# EasyEDA Pro project Projeto2.eprj

# Schematic Esquema com BJT
Board Name: Board1; Create Date: 2026-02-03; Page Name: P1; Project Name: Projeto2; Schematic Name: Schematic1; Update Date: 2026-02-03; Company: EasyEDA.com; Page Size: A4; Version: V1.0
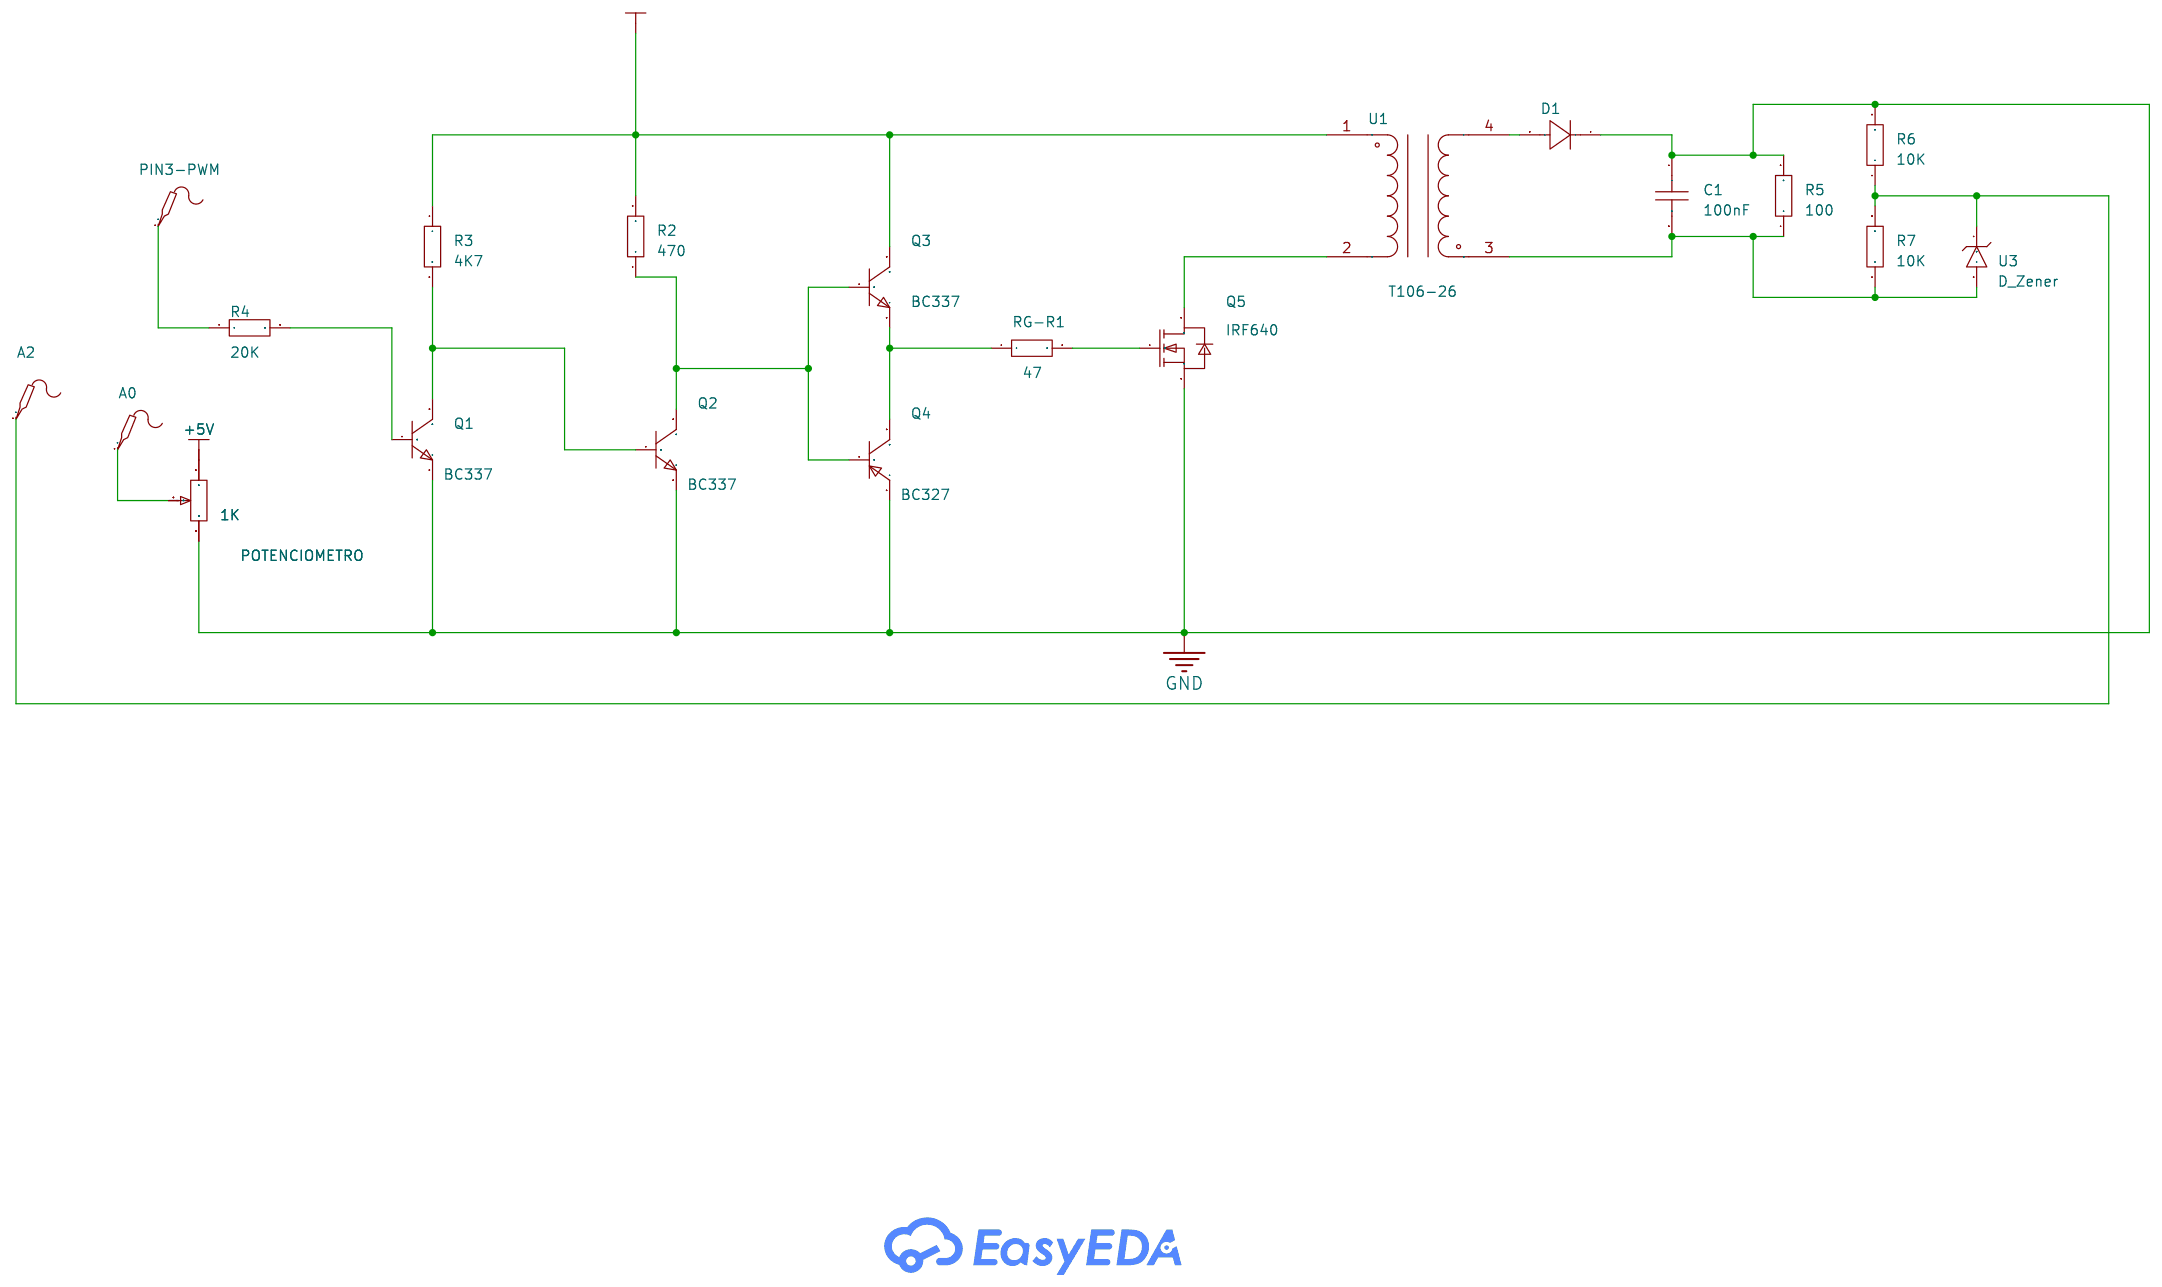
[diagram p0: schematic sheet]

## Parts
A0  -  [Test-Point-0.5mm]
A2  -  [Test-Point-0.5mm]
C1  100nF  [C0201]
D1  -  [DO-41_BD2.4-L4.7-P8.70-D0.9-RD]
PIN3-PWM  -  [Test-Point-0.5mm]
POTENCIOMETRO  1K  [RES-ADJ-TH_3P-L9.5-W9.5-P2.54-BR-BS]
Q1  BC337  [SOT-23_L2.9-W1.3-P1.90-LS2.4-BR]
Q2  BC337  [SOT-23_L2.9-W1.3-P1.90-LS2.4-BR]
Q3  BC337  [SOT-23_L2.9-W1.3-P1.90-LS2.4-BR]
Q4  BC327  [TO-236-3_L2.9-W1.3-P1.90-LS2.4-BR]
Q5  IRF640  [TO-220-3_L10.0-W4.5-P2.54-L]
R2  470  [R0603]
R3  4K7  [R0603]
R4  20K  [R0603]
R5  100  [R0603]
R6  10K  [R0603]
R7  10K  [R0603]
RG-R1  47  [R0603]
U1  T106-26  [XFMR-TH_TCC-J2208-5MH]
U3  D_Zener  [SOD-323_L1.6-W1.2-LS2.6-RD]

## Library data of the parts
A0 A2 PIN3-PWM = Test-Point
C1 = CAP_0201: Supplier Footprint: 0201
D1 = 1N4007: Supplier Footprint: DO-41
POTENCIOMETRO = R_3386P: Supplier Footprint: Through
Q1-Q3 = S8050_NPN: Supplier Footprint: SOT-23
Q4 = S8550_PNP: Supplier Footprint: SOT-23
Q5 = IRF640: LCSC Part Name: N沟道,电流:18A,耐压:200V; Supplier Part: C5122558; Manufacturer: Slkor(萨科微); Supplier Footprint: TO-220; JLCPCB Part Class: Extended Part; Datasheet: https://atta.szlcsc.com/upload/public/pdf/source/20220805/B38E3581582BB90DD5297E6153D4DFE0.pdf; Supplier: LCSC; Type: 1 N-channel; Current - Continuous Drain(Id): 18A; Pd - Power Dissipation: 150W; Operating Temperature: -55℃~+175℃
R2-R7 RG-R1 = Res_0603: Supplier Footprint: 0603
U1 = TCC-WJ2812-303D: Supplier Part: C9900046386; Supplier Footprint: EE13; Supplier: LCSC
U3 = D_Zener_SOD323: Supplier Part: C2929304; Supplier Footprint: SOD-323; JLCPCB Part Class: Extended Part; Supplier: LCSC

## Nets
+5V: POTENCIOMETRO.1
GND: C1.1 D1.1(K) POTENCIOMETRO.3 Q1.2(E) Q2.2(E) Q4.2(E) Q5.3(S) R5.2 R6.2
VCC-12V: Q3.3(C) R2.2 R3.1 U1.1
Net-(A0-1): A0.1 POTENCIOMETRO.2
Net-(A2-1): A2.1 R6.1 R7.2 U3.1(C)
Net-(C1-2): C1.2 R5.1 R7.1 U1.3 U3.2(A)
Net-(D1-2): D1.2(A) U1.4
Net-(PIN3-PWM-1): PIN3-PWM.1 R4.1
Net-(Q1-1): Q1.1(B) R4.2
Net-(Q1-3): Q1.3(C) Q2.1(B) R3.2
Net-(Q2-3): Q2.3(C) Q3.1(B) Q4.1(B) R2.1
Net-(Q3-2): Q3.2(E) Q4.3(C) RG-R1.1
Net-(Q5-1): Q5.1(G) RG-R1.2
Net-(Q5-2): Q5.2(D) U1.2

# Schematic Esquema com Opto Acoplador
Create Date: 2026-02-03; Page Name: P1; Project Name: Projeto2; Schematic Name: Esquema com Opto Acoplador; Update Date: 2026-02-07; Company: EasyEDA.com; Page Size: A4; Version: V1.0
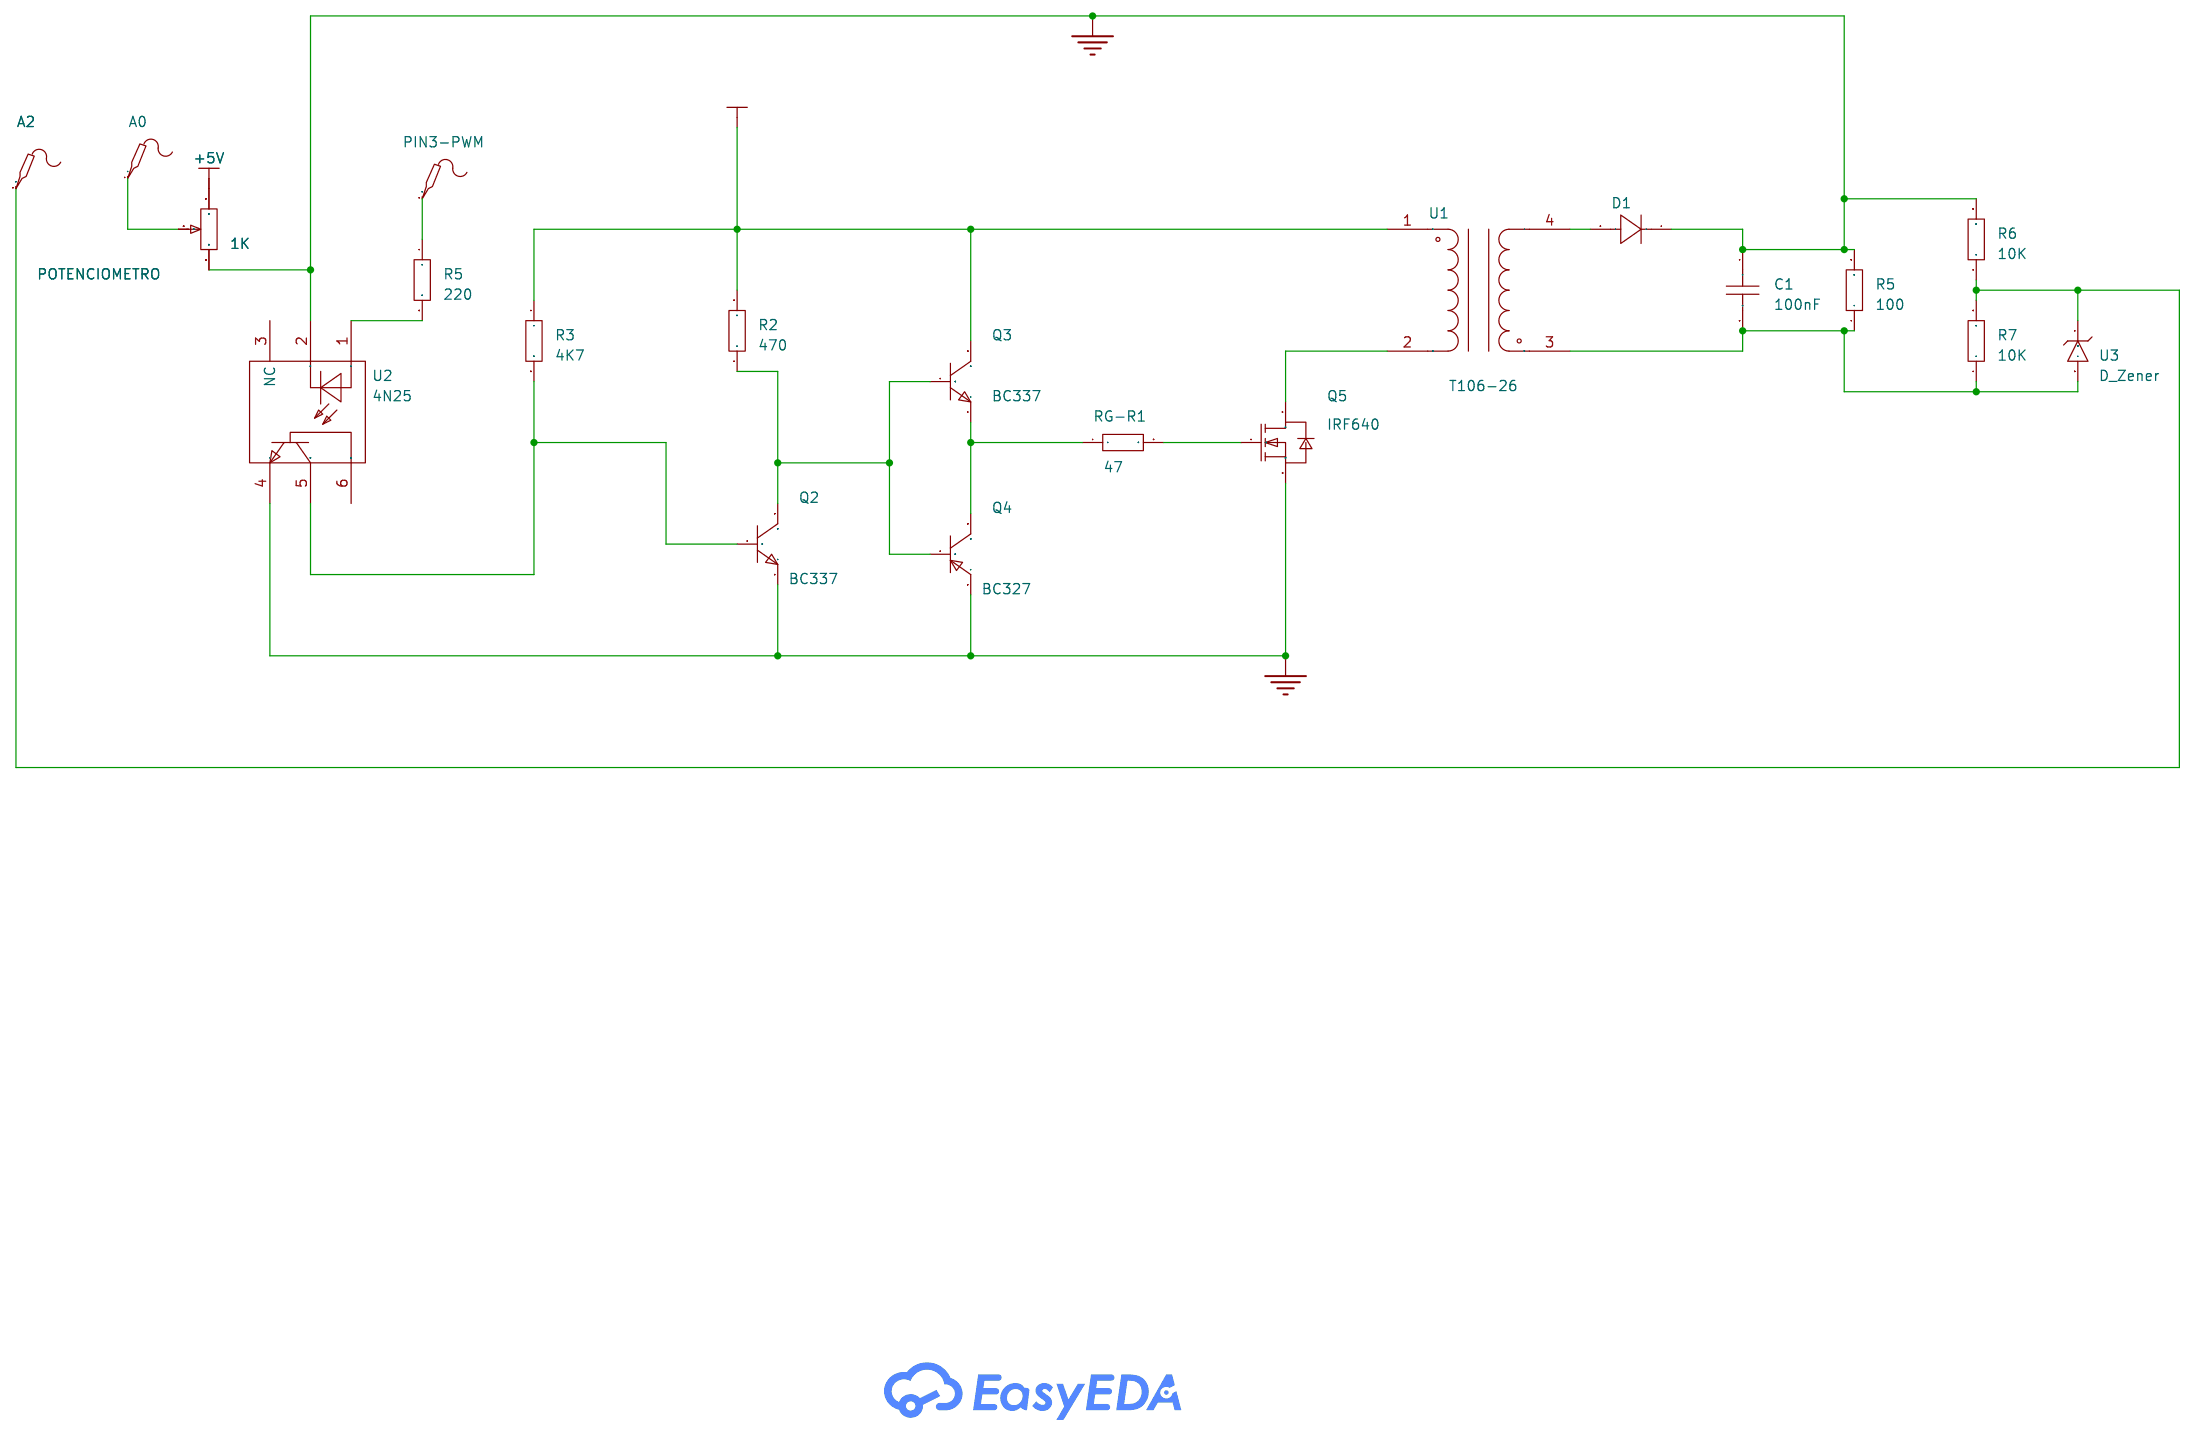
[diagram p1: schematic sheet]

## Parts
A0  -  [Test-Point-0.5mm]
A2  -  [Test-Point-0.5mm]
C1  100nF  [C0201]
D1  -  [DO-41_BD2.4-L4.7-P8.70-D0.9-RD]
PIN3-PWM  -  [Test-Point-0.5mm]
POTENCIOMETRO  1K  [RES-ADJ-TH_3P-L9.5-W9.5-P2.54-BR-BS]
Q2  BC337  [SOT-23_L2.9-W1.3-P1.90-LS2.4-BR]
Q3  BC337  [SOT-23_L2.9-W1.3-P1.90-LS2.4-BR]
Q4  BC327  [TO-236-3_L2.9-W1.3-P1.90-LS2.4-BR]
Q5  IRF640  [TO-220-3_L10.0-W4.5-P2.54-L]
R2  470  [R0603]
R3  4K7  [R0603]
R5  100  [R0603]
R5#2  220  [R0603]
R6  10K  [R0603]
R7  10K  [R0603]
RG-R1  47  [R0603]
U1  T106-26  [XFMR-TH_TCC-J2208-5MH]
U2  4N25  [DIP-6_L7.1-W6.5-P2.54-LS7.6-BL]
U3  D_Zener  [SOD-323_L1.6-W1.2-LS2.6-RD]

## Library data of the parts
A0 A2 PIN3-PWM = Test-Point
C1 = CAP_0201: Supplier Footprint: 0201
D1 = 1N4007: Supplier Footprint: DO-41
POTENCIOMETRO = R_3386P: Supplier Footprint: Through
Q2 Q3 = S8050_NPN: Supplier Footprint: SOT-23
Q4 = S8550_PNP: Supplier Footprint: SOT-23
Q5 = IRF640: LCSC Part Name: N沟道,电流:18A,耐压:200V; Supplier Part: C5122558; Manufacturer: Slkor(萨科微); Supplier Footprint: TO-220; JLCPCB Part Class: Extended Part; Datasheet: https://atta.szlcsc.com/upload/public/pdf/source/20220805/B38E3581582BB90DD5297E6153D4DFE0.pdf; Supplier: LCSC; Type: 1 N-channel; Current - Continuous Drain(Id): 18A; Pd - Power Dissipation: 150W; Operating Temperature: -55℃~+175℃
R2 R3 R5 R5#2 R6 R7 RG-R1 = Res_0603: Supplier Footprint: 0603
U1 = TCC-WJ2812-303D: Supplier Part: C9900046386; Supplier Footprint: EE13; Supplier: LCSC
U2 = 4N25: Supplier Part: C3008818; Manufacturer: VISHAY(威世); Supplier Footprint: DIP-6; JLCPCB Part Class: Extended Part; Datasheet: https://atta.szlcsc.com/upload/public/pdf/source/20220512/DCD730118474C0EE1EA694047C839E34.pdf; Supplier: LCSC; Forward Voltage: 1.3V; Output Current: 50mA; Isolation Voltage(rms): 5kV; Number of Outputs: 1; Rise time: 2us; Fall time: 2us; Operating Temperature: -55℃~+100℃
U3 = D_Zener_SOD323: Supplier Part: C2929304; Supplier Footprint: SOD-323; JLCPCB Part Class: Extended Part; Supplier: LCSC

## Nets
+5V: POTENCIOMETRO.1
GND_ARDUINO: C1.1 D1.1(K) POTENCIOMETRO.3 R5.2 R6.2 U2.2
GND_FONTE: Q2.2(E) Q4.2(E) Q5.3(S) U2.4
VCC-12V: Q3.3(C) R2.2 R3.1 U1.1
Net-(A0-1): A0.1 POTENCIOMETRO.2
Net-(A2-1): A2.1 R6.1 R7.2 U3.1(C)
Net-(C1-2): C1.2 R5.1 R7.1 U1.3 U3.2(A)
Net-(D1-2): D1.2(A) U1.4
Net-(PIN3-PWM-1): PIN3-PWM.1 R5#2.1
Net-(Q2-1): Q2.1(B) R3.2 U2.5
Net-(Q2-3): Q2.3(C) Q3.1(B) Q4.1(B) R2.1
Net-(Q3-2): Q3.2(E) Q4.3(C) RG-R1.1
Net-(Q5-1): Q5.1(G) RG-R1.2
Net-(Q5-2): Q5.2(D) U1.2
Net-(R5#2-2): R5#2.2 U2.1

Not connected (* = marked no-connect by the designer): U2 3(NC) 6

# Schematic Esquema Malha Fechada
Board Name: Board1_1; Create Date: 2026-02-09; Page Name: P1; Project Name: Projeto2; Schematic Name: Esquema Malha Fechada; Update Date: 2026-02-08; Company: EasyEDA.com; Page Size: A4; Version: V1.0
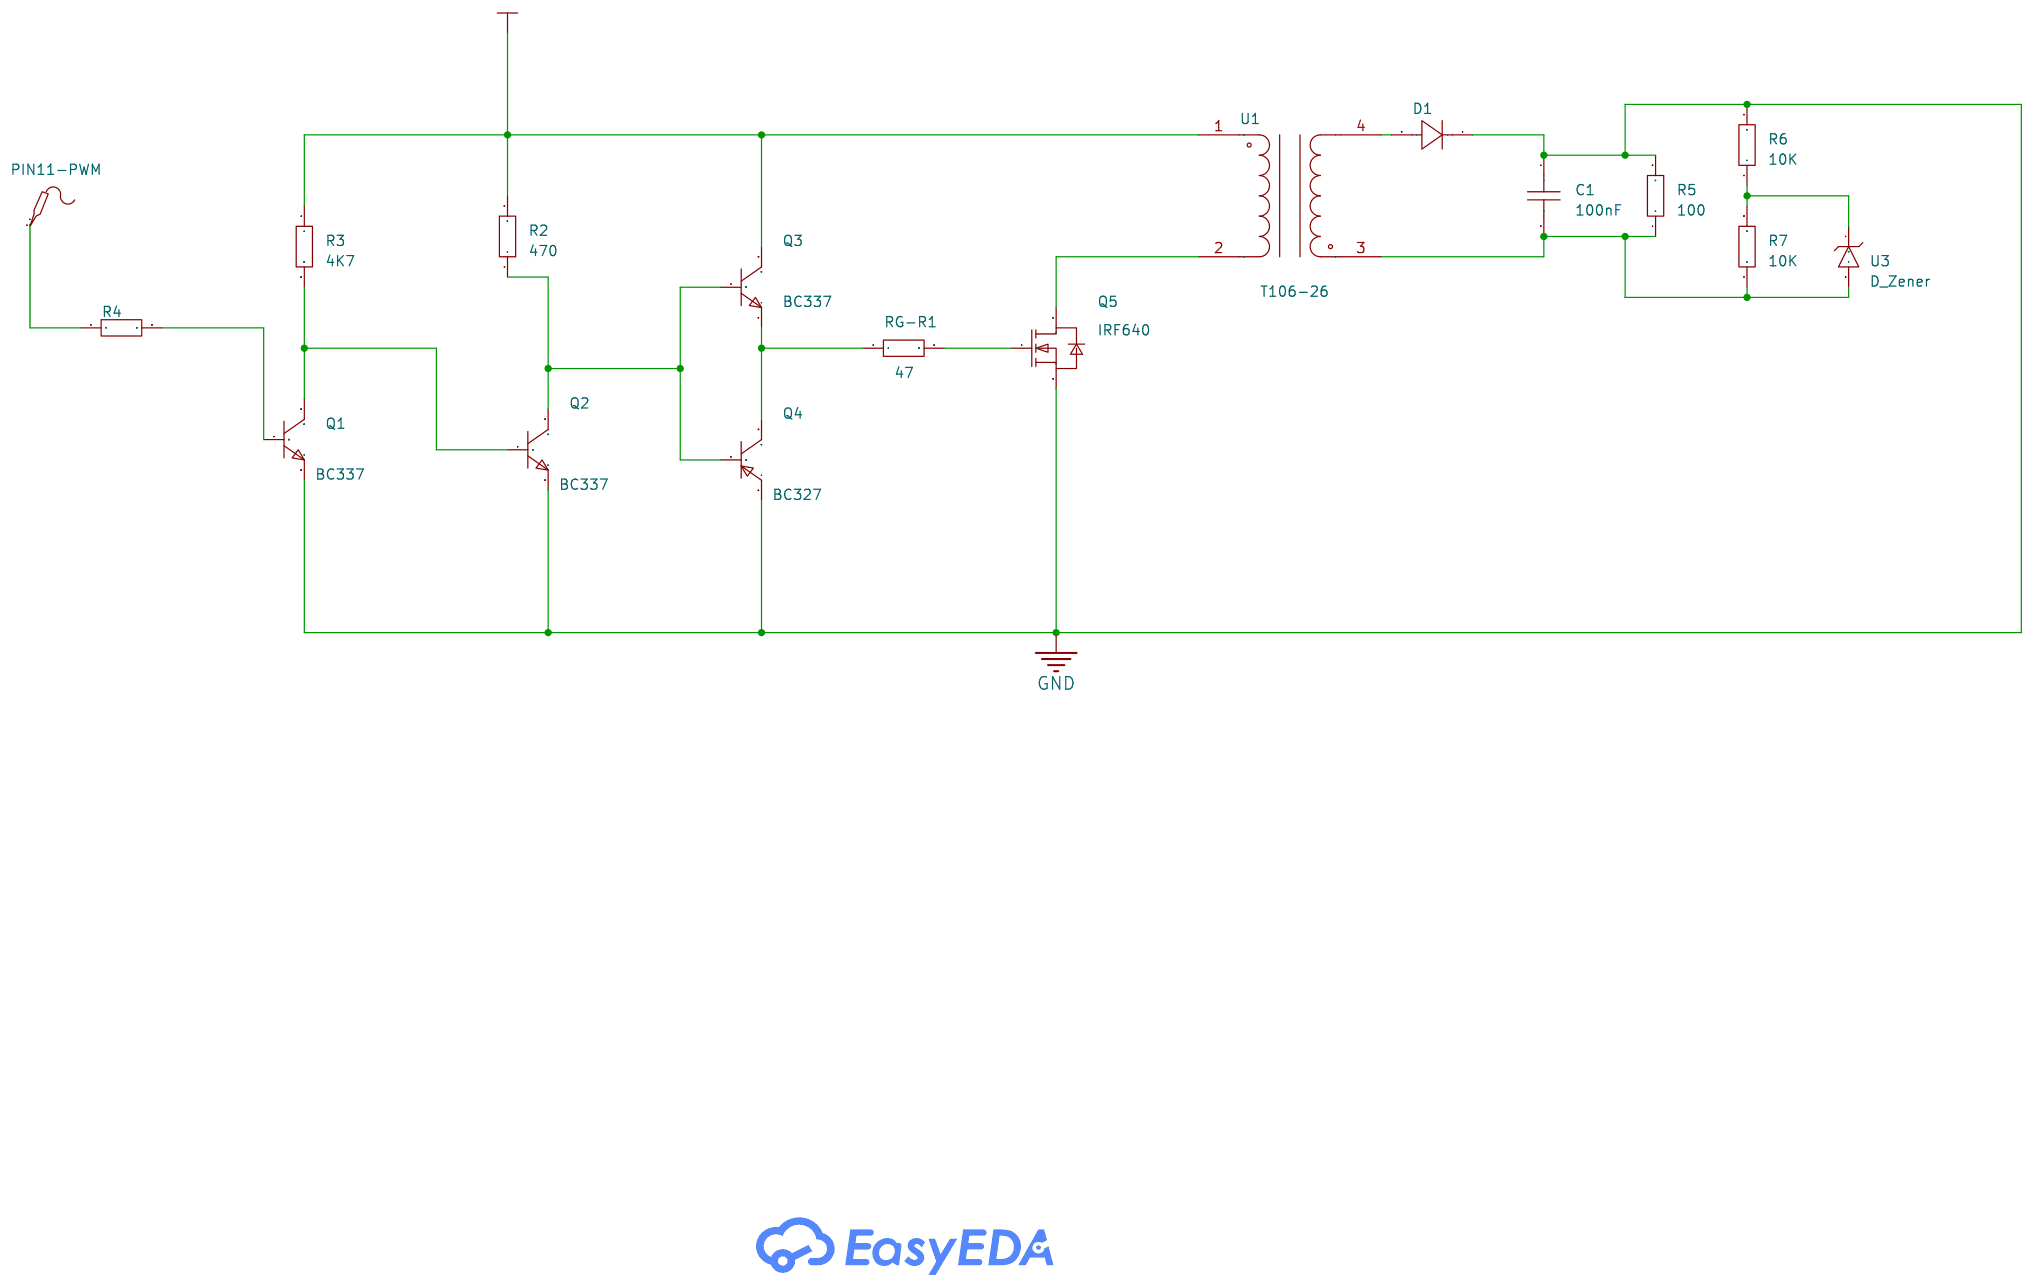
[diagram p2: schematic sheet]

## Parts
C1  100nF  [C0201]
D1  -  [DO-41_BD2.4-L4.7-P8.70-D0.9-RD]
PIN11-PWM  -  [Test-Point-0.5mm]
Q1  BC337  [SOT-23_L2.9-W1.3-P1.90-LS2.4-BR]
Q2  BC337  [SOT-23_L2.9-W1.3-P1.90-LS2.4-BR]
Q3  BC337  [SOT-23_L2.9-W1.3-P1.90-LS2.4-BR]
Q4  BC327  [TO-236-3_L2.9-W1.3-P1.90-LS2.4-BR]
Q5  IRF640  [TO-220-3_L10.0-W4.5-P2.54-L]
R2  470  [R0603]
R3  4K7  [R0603]
R4  20K  [R0603]
R5  100  [R0603]
R6  10K  [R0603]
R7  10K  [R0603]
RG-R1  47  [R0603]
U1  T106-26  [XFMR-TH_TCC-J2208-5MH]
U3  D_Zener  [SOD-323_L1.6-W1.2-LS2.6-RD]

## Library data of the parts
C1 = CAP_0201: Supplier Footprint: 0201
D1 = 1N4007: Supplier Footprint: DO-41
PIN11-PWM = Test-Point
Q1-Q3 = S8050_NPN: Supplier Footprint: SOT-23
Q4 = S8550_PNP: Supplier Footprint: SOT-23
Q5 = IRF640: LCSC Part Name: N沟道,电流:18A,耐压:200V; Supplier Part: C5122558; Manufacturer: Slkor(萨科微); Supplier Footprint: TO-220; JLCPCB Part Class: Extended Part; Datasheet: https://atta.szlcsc.com/upload/public/pdf/source/20220805/B38E3581582BB90DD5297E6153D4DFE0.pdf; Supplier: LCSC; Type: 1 N-channel; Current - Continuous Drain(Id): 18A; Pd - Power Dissipation: 150W; Operating Temperature: -55℃~+175℃
R2-R7 RG-R1 = Res_0603: Supplier Footprint: 0603
U1 = TCC-WJ2812-303D: Supplier Part: C9900046386; Supplier Footprint: EE13; Supplier: LCSC
U3 = D_Zener_SOD323: Supplier Part: C2929304; Supplier Footprint: SOD-323; JLCPCB Part Class: Extended Part; Supplier: LCSC

## Nets
GND: C1.1 D1.1(K) Q1.2(E) Q2.2(E) Q4.2(E) Q5.3(S) R5.2 R6.2
VCC-12V: Q3.3(C) R2.2 R3.1 U1.1
Net-(C1-2): C1.2 R5.1 R7.1 U1.3 U3.2(A)
Net-(D1-2): D1.2(A) U1.4
Net-(PIN11-PWM-1): PIN11-PWM.1 R4.1
Net-(Q1-1): Q1.1(B) R4.2
Net-(Q1-3): Q1.3(C) Q2.1(B) R3.2
Net-(Q2-3): Q2.3(C) Q3.1(B) Q4.1(B) R2.1
Net-(Q3-2): Q3.2(E) Q4.3(C) RG-R1.1
Net-(Q5-1): Q5.1(G) RG-R1.2
Net-(Q5-2): Q5.2(D) U1.2
Net-(R6-1): R6.1 R7.2 U3.1(C)
